# EasyEDA Pro project ProDoc_HyperCardReader_2024-07-06.epro

# Schematic HyperCardReader
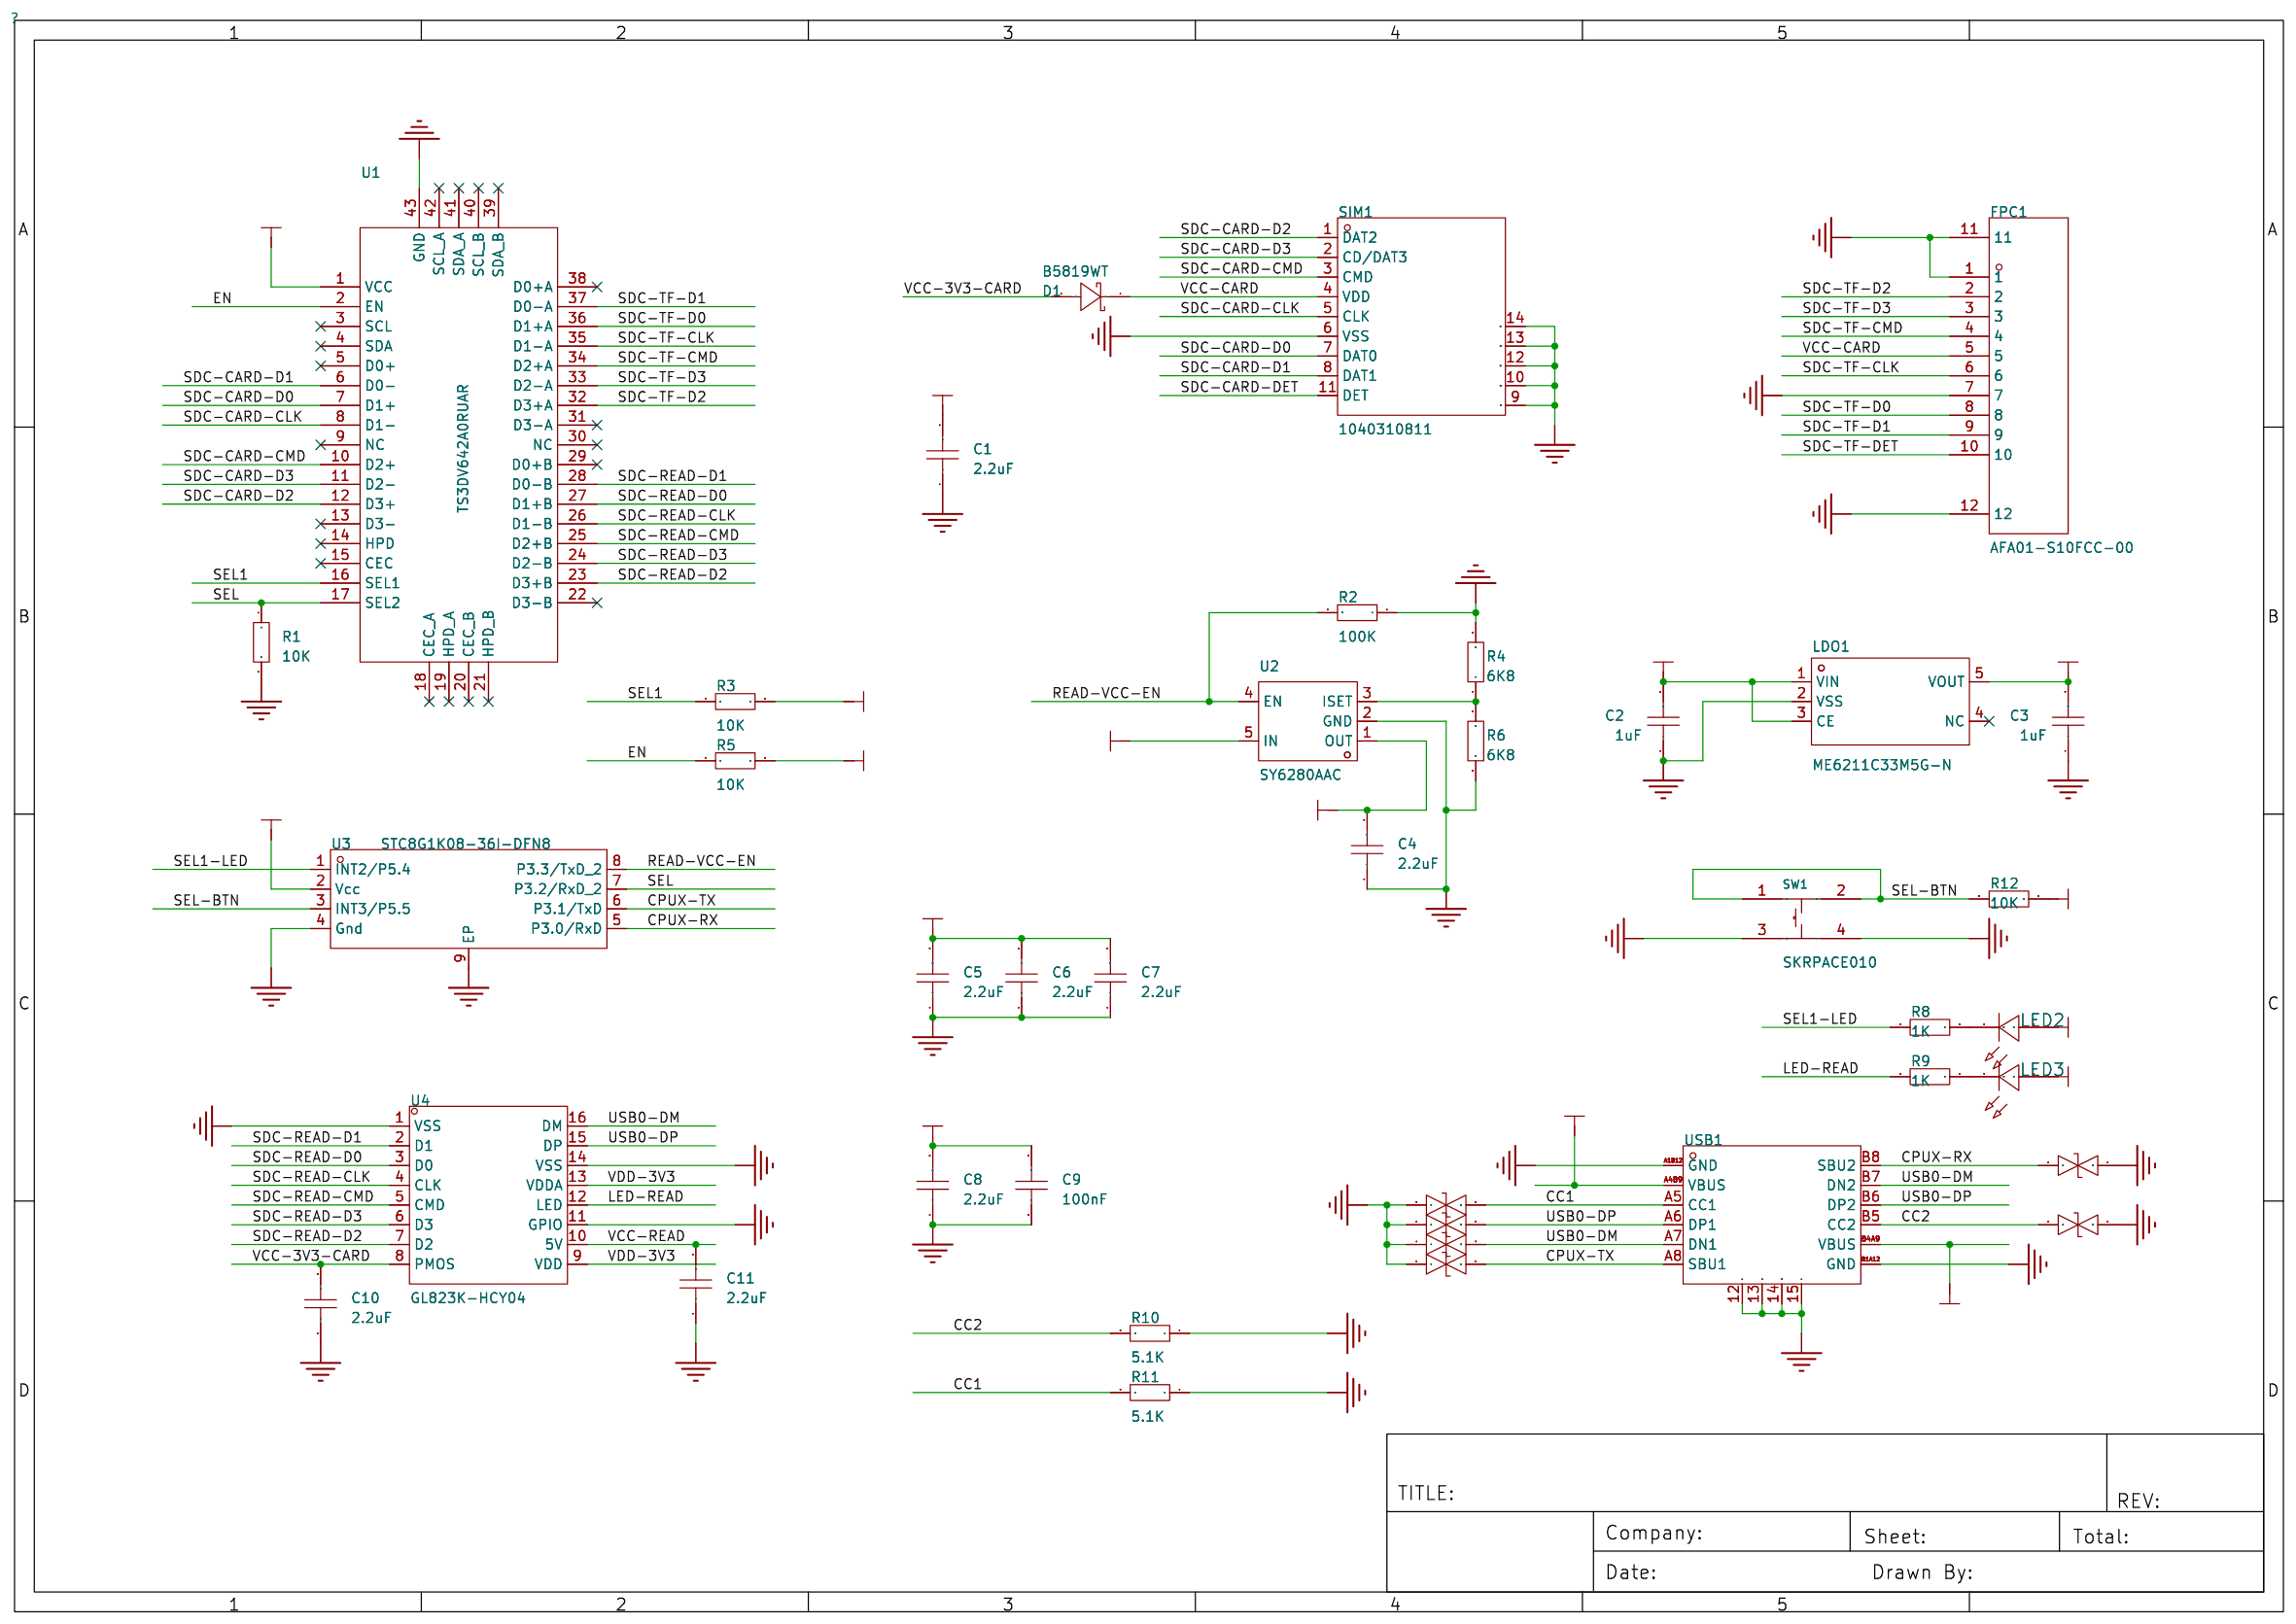
[diagram p0: schematic sheet]

## Parts
C1  2.2uF  [c0402-nsk]
C2  1uF  [C0603-NSK]
C3  1uF  [C0603-NSK]
C4  2.2uF  [c0402-nsk]
C5  2.2uF  [c0402-nsk]
C6  2.2uF  [c0402-nsk]
C7  2.2uF  [c0402-nsk]
C8  2.2uF  [c0402-nsk]
C9  100nF  [c0402-nsk]
C10  2.2uF  [c0402-nsk]
C11  2.2uF  [c0402-nsk]
D1  B5819WT  [SOD-523_L1.2-W0.8-LS1.6-RD-1 NSK]
D2  0402ESDA-05N  [d0402]
D3  0402ESDA-05N  [d0402]
D4  0402ESDA-05N  [d0402]
D5  0402ESDA-05N  [d0402]
D6  0402ESDA-05N  [d0402]
D7  0402ESDA-05N  [d0402]
FPC1  AFA01-S10FCC-00  [FPC-SMD_AFA01-S10FCC-00]
LDO1  ME6211C33M5G-N  [SOT-23-5_L3.0-W1.7-P0.95-LS2.8-BL]
LED2  -  [LED_0603]
LED3  -  [LED_0603]
R1  10K  [r0201 nsk]
R2  100K  [r0201 nsk]
R3  10K  [r0201 nsk]
R4  6K8  [r0201 nsk]
R5  10K  [r0201 nsk]
R6  6K8  [r0201 nsk]
R8  1K  [r0201 nsk]
R9  1K  [r0201 nsk]
R10  5.1K  [r0201 nsk]
R11  5.1K  [r0201 nsk]
R12  10K  [r0201 nsk]
SIM1  1040310811  [SIM-SMD_8P-1040310811]
SW1  SKRPACE010  [KEY-SMD_4P-L4.2-W3.2-P2.20-LS4.6]
U1  TS3DV642A0RUAR  [WFQFN-42_L9.0-W3.5-P0.50-BL-EP]
U2  SY6280AAC  [SOT-23-5_L3.0-W1.7-P0.95-LS2.8-BL]
U3  STC8G1K08-36I-DFN8  [DFN-8_L3.0-W3.0-P0.50-BL-EP]
U4  GL823K-HCY04  [SSOP-16_L4.9-W3.9-P0.64-LS6.0-BL]
USB1  -  [USB-C-SMD_TYPEC-304-BCP16-1]

## Library data of the parts
C1 C4-C11 = CAP_0402: Supplier Footprint: 0402
C2 C3 = CAP_0603: Supplier Footprint: 0603
D1 = B5819WT_C2997265: 二极管配置:-;正向压降(Vf):600mV@200mA;直流反向耐压(Vr):40V;平均整流电流(Io):1A;; LCSC Part Name: 电压:40V 电流:1A; Supplier Part: C2997265; Manufacturer: BORN(伯恩半导体); Supplier Footprint: SOD-523; JLCPCB Part Class: 扩展库; Datasheet: https://atta.szlcsc.com/upload/public/pdf/source/20220826/529B3A9034D5C6632B715AD177467069.pdf; Supplier: LCSC; Forward Voltage (Vf@If): 600mV@200mA; Reverse Voltage (Vr): 40V; Average Rectified Current (Io): 1A; Reverse Leakage Current (Ir): 5uA@30V
D2-D7 = 0402ESDA-05N: 极性:Bidirectional;反向关断电压（典型值）:5V;击穿电压（最小值）:-;箝位电压:50V;峰值脉冲电流（10/1000us）:-;; Supplier Part: C316049; Manufacturer: BORN伯恩半导体; Supplier Footprint: 0402; JLCPCB Part Class: Extended Part; Datasheet: https://atta.szlcsc.com/upload/public/pdf/source/20181026/C316049_37ABAC87650F175221BFB473159300DE.pdf; Supplier: LCSC; Polarity: Bidirectional; Reverse Stand-Off Voltage (Vrwm): 5V; Clamping Voltage@Ipp: 50V; Voltage - Reverse Standoff (Typ): 5V; Voltage - Clamping (Max) @ Ipp: 50V
FPC1 = AFA01-S10FCC-00: 锁定特性:翻盖式;触点类型:下接;触点数量:10P;间距:1mm;安装类型:卧贴;; LCSC Part Name: 间距:1mm P数:10P 翻盖式 下接; Supplier Part: C262385; Manufacturer: JS(钜硕电子); Supplier Footprint: SMD,P=1mm,卧贴; JLCPCB Part Class: 扩展库; Datasheet: https://atta.szlcsc.com/upload/public/pdf/source/20180820/C262762_EBECD0847A529CA64FD00527F6604CA9.pdf; Supplier: LCSC; Locking Feature: 翻盖式; Contact Type: 下接; Number of Contacts: 10P; Pitch: 1mm; Mounting Type: 卧贴; FFC, FCB Thickness: 0.3mm; Height Above Board: 2mm
LDO1 = ME6211C33M5G-N: 输出类型:固定;最大输入电压:6V;输出电压:3.3V;最大输出电流:500mA;电源纹波抑制比(PSRR):70dB;输出极性:正极;; LCSC Part Name: 输入6V 输出3.3V 500mA; Supplier Part: C82942; Manufacturer: MICRONE(南京微盟); Supplier Footprint: SOT-23-5; JLCPCB Part Class: 扩展库; Datasheet: https://atta.szlcsc.com/upload/public/pdf/source/20170918/C82942_1505727073070976520.pdf; Supplier: LCSC; Output Type: 固定; Maximum Input Voltage: 6V; Output Voltage: 3.3V; MAX Output Current: 500mA; Power Supply Rejection Ratio (PSRR): 70dB; Dropout Voltage: 260mV@(200mA); Output Polarity: 正极; Number of Outputs: 1
LED2 LED3 = LED_0603-R: Supplier Footprint: 0603
R1-R6 R8-R12 = Res_0201: Supplier Footprint: 0201
SIM1 = 1040310811: 卡连接方式:拔插式;卡类型:MicroSD卡(TF卡);连接器类型:卡座;本体最大高度:1.42mm;触头镀层:金;工作温度范围:-;; LCSC Part Name: 拔插式 MicroSD卡(TF卡) 卡座; Supplier Part: C585350; Manufacturer: MOLEX; Supplier Footprint: SMD; JLCPCB Part Class: 扩展库; Datasheet: https://atta.szlcsc.com/upload/public/pdf/source/20201117/C585350_D1F0B30BD23514449186B2E50ACE8BBF.pdf; Supplier: LCSC; Card Connection Mode: 拔插式; Card Type: MicroSD卡(TF卡); Connector Type: 卡座; Maximum Body Height: 1.42mm; Contact Plating: 金
SW1 = SKRPACE010: 电路结构:单刀单掷;按钮形状:椭圆形按钮;安装方式:立贴;开关长度:4.2mm;开关宽度:3.2mm;开关高度:2.5mm;触点电流:50mA;额定电压(DC):16V;带灯:-;机械寿命:-;; LCSC Part Name: 4.2*3.2*2.5mm 立贴 轻触开关; Supplier Part: C139797; Manufacturer: ALPSALPINE(阿尔卑斯阿尔派); Supplier Footprint: SMD; JLCPCB Part Class: 扩展库; Datasheet: https://atta.szlcsc.com/upload/public/pdf/source/20171113/C139797_15105612676371115729.pdf; Supplier: LCSC; Circuit: 单刀单掷; Actuator Style: 椭圆形按钮; Mounting Style: 立贴; Switch Length: 4.2mm; Switch Width: 3.2mm; Switch Height: 2.5mm; Contact Current: 50mA; Voltage Rating (DC): 16V
U1 = TS3DV642A0RUAR: 开关电路:-;; Supplier: LCSC; Supplier Part: C157482; Manufacturer: TI(德州仪器); Supplier Footprint: WFQFN-42-EP(3.5x9); Datasheet: https://www.ti.com/cn/lit/gpn/ts3dv642
U2 = SY6280AAC_C55136: 低能耗配电开关; Supplier Part: C55136; Manufacturer: silergy(矽力杰); Supplier Footprint: SOT-23-5; JLCPCB Part Class: 扩展库; Datasheet: https://atta.szlcsc.com/upload/public/pdf/source/20161108/1478586372822.pdf; Supplier: LCSC
U3 = STC8G1K08-36I-DFN8: CPU内核:51系列;程序存储容量:8KB;RAM总容量:1.25KB;GPIO端口数量:6;工作电压范围:1.9V~5.5V;CPU最大主频:-;程序存储器类型:FLASH;; Supplier Part: C915662; Manufacturer: STC(宏晶); Supplier Footprint: DFN-8-EP(3x3); JLCPCB Part Class: 扩展库; Datasheet: https://atta.szlcsc.com/upload/public/pdf/source/20230914/7707908C45C6343AE73767C1466DDB8D.pdf; Supplier: LCSC; CPU Core: 51系列; Program Storage Size: 8KB; RAM Size: 1.25KB; GPIO Ports Number: 6; Operating Voltage Range: 1.9V~5.5V; Program Memory Type: FLASH; Operating Temperature Range: -40℃~+85℃; 16Bit Timer: 2; UART/USART: 1; I2C: 1; SPI: 1; Peripheral/Function: 低电压检测；看门狗；除法器；乘法器; Watchdog: 有; Low-Voltage Detect: 有; Internal Oscillator: 有
U4 = GL823K-HCY04: 应用功能:-;接口协议:-;; Supplier Part: C284879; Manufacturer: GENESYS(创惟); Supplier Footprint: SSOP-16-150mil; JLCPCB Part Class: 扩展库; Datasheet: https://atta.szlcsc.com/upload/public/pdf/source/20190212/C284879_D3054E8AA735401C3047DCECFFFED6D3.pdf; Supplier: LCSC
USB1 = TYPEC-304-BCP16: Pin Type: IN; Supplier: LCSC; Supplier Part: C720629; Manufacturer: XUNPU; JLCPCB Part Class: 扩展库; Check: false

## Nets
GND: C1.1 C2.1 C3.1 C4.1 C5.1 C6.1 C7.1 C8.1 C9.1 C10.1 C11.1 D2.1 D3.1 D4.1 D5.1 D6.1 D7.1 FPC1.1 FPC1.7 FPC1.11 FPC1.12 LDO1.2(VSS) R1.2 R2.1 R4.2 R6.1 R10.1 R11.1 SIM1.6(VSS) SIM1.9 SIM1.10 SIM1.12 SIM1.13 SIM1.14 SW1.3 SW1.4 U1.43(GND) U2.2(GND) U3.4(Gnd) U3.9(EP) U4.1(VSS) U4.11(GPIO) U4.14(VSS) USB1.12(1) USB1.13(2) USB1.14(3) USB1.15(4) USB1.A1B12(GND) USB1.B1A12(GND)
VBUS-USB: C2.2 C5.2 C6.2 C7.2 LDO1.1(VIN) LDO1.3(CE) U2.5(IN) USB1.A4B9(VBUS) USB1.B4A9(VBUS)
VCC-3V3-CARD: C10.2 D1.2(A) U4.8(PMOS)
VCC-3V3-LDO: C3.2 LDO1.5(VOUT) LED2.2(A) R3.2 R5.2 R12.1 U1.1(VCC) U3.2(Vcc)
VCC-CARD: C1.2 D1.1(K) FPC1.5 SIM1.4(VDD)
VCC-READ: C4.2 C11.2 U2.1(OUT) U4.10(5V)
VDD-3V3: C8.2 C9.2 LED3.2(A) U4.9(VDD) U4.13(VDDA)
CC1: D3.2 R11.2 USB1.A5(CC1)
CC2: D6.2 R10.2 USB1.B5(CC2)
CPUX-RX: D2.2 U3.5(P3.0/RxD) USB1.B8(SBU2)
CPUX-TX: D7.2 U3.6(P3.1/TxD) USB1.A8(SBU1)
EN: R5.1 U1.2(EN)
LED-READ: R9.2 U4.12(LED)
READ-VCC-EN: R2.2 U2.4(EN) U3.8(P3.3/TxD_2)
SDC-CARD-CLK: SIM1.5(CLK) U1.8(D1-)
SDC-CARD-CMD: SIM1.3(CMD) U1.10(D2+)
SDC-CARD-D0: SIM1.7(DAT0) U1.7(D1+)
SDC-CARD-D1: SIM1.8(DAT1) U1.6(D0-)
SDC-CARD-D2: SIM1.1(DAT2) U1.12(D3+)
SDC-CARD-D3: SIM1.2(CD/DAT3) U1.11(D2-)
SDC-CARD-DET: SIM1.11(DET)
SDC-READ-CLK: U1.26(D1-B) U4.4(CLK)
SDC-READ-CMD: U1.25(D2+B) U4.5(CMD)
SDC-READ-D0: U1.27(D1+B) U4.3(D0)
SDC-READ-D1: U1.28(D0-B) U4.2(D1)
SDC-READ-D2: U1.23(D3+B) U4.7(D2)
SDC-READ-D3: U1.24(D2-B) U4.6(D3)
SDC-TF-CLK: FPC1.6 U1.35(D1-A)
SDC-TF-CMD: FPC1.4 U1.34(D2+A)
SDC-TF-D0: FPC1.8 U1.36(D1+A)
SDC-TF-D1: FPC1.9 U1.37(D0-A)
SDC-TF-D2: FPC1.2 U1.32(D3+A)
SDC-TF-D3: FPC1.3 U1.33(D2-A)
SDC-TF-DET: FPC1.10
SEL: R1.1 U1.17(SEL2) U3.7(P3.2/RxD_2)
SEL1: R3.1 U1.16(SEL1)
SEL1-LED: R8.2 U3.1(INT2/P5.4)
SEL-BTN: R12.2 SW1.1 SW1.2 U3.3(INT3/P5.5)
USB0-DM: D5.2 U4.16(DM) USB1.A7(DN1) USB1.B7(DN2)
USB0-DP: D4.2 U4.15(DP) USB1.A6(DP1) USB1.B6(DP2)
$1N1961: R4.1 R6.2 U2.3(ISET)
$1N4375: LED3.1(C) R9.1
$1N4433: LED2.1(C) R8.1

Not connected (* = marked no-connect by the designer): LDO1 4(NC)*; U1 3(SCL)* 4(SDA)* 5(D0+)* 9(NC)* 13(D3-)* 14(HPD)* 15(CEC)* 18(CEC_A)* 19(HPD_A)* 20(CEC_B)* 21(HPD_B)* 22(D3-B)* 29(D0+B)* 30(NC)* 31(D3-A)* 38(D0+A)* 39(SDA_B)* 40(SCL_B)* 41(SDA_A)* 42(SCL_A)*

# Board HyperCardReader
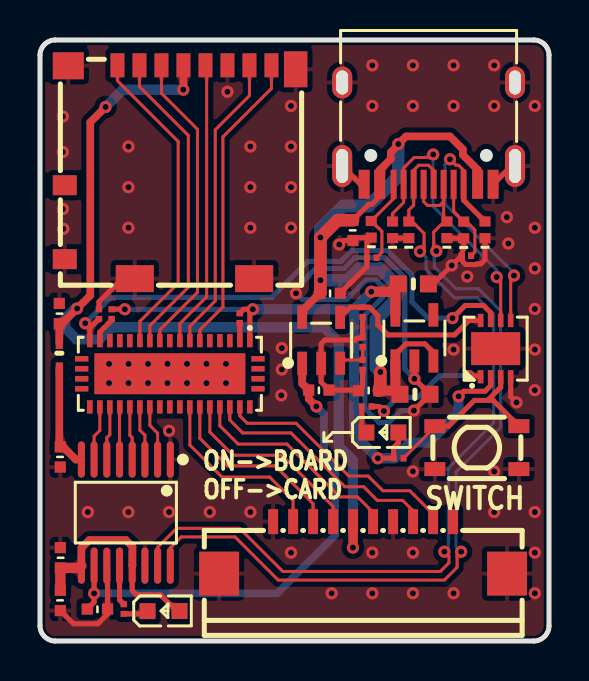
[diagram p1: board, top side]
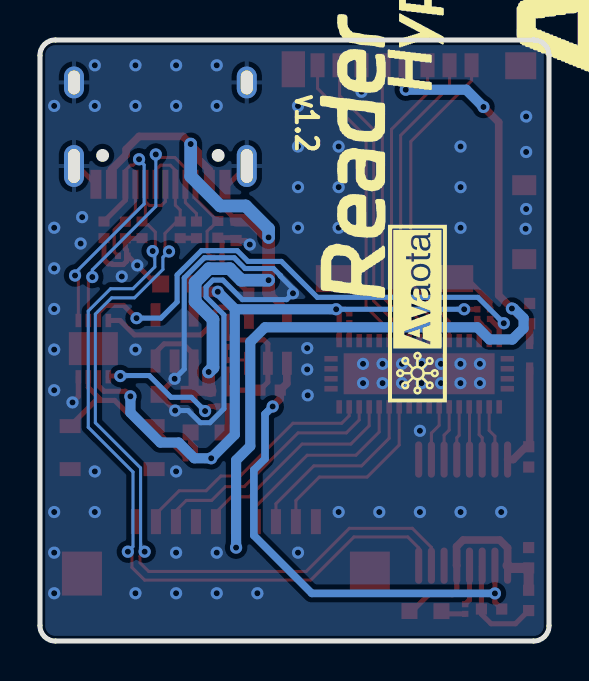
[diagram p2: board, bottom side, seen from below]

Outline 25.45 x 30.07 mm; copper layers: Top Layer, Bottom Layer. Coordinates in mm from the lower left corner of the outline.
Outline path: 0,29.31 0,0.76 arc(0.22,0.22) 0.76,0 24.69,0 arc(25.23,0.22) 25.45,0.76 25.45,29.31 arc(25.23,29.85) 24.69,30.07 0.76,30.07 arc(0.22,29.85) 0,29.31
Stack: Top Layer 0.035mm / Dielectric1 1.51mm FR4 er 4.5 / Bottom Layer 0.035mm

## Design rules (mm)
template: JLCPCB Capability(Two Layers Board)
spacing copperThickness1oz (default): track to track 0.102, other pairs 0.152 to 0.3
spacing copperThickness2oz: track to track 0.203, other pairs 0.152 to 0.3
track width copperThickness1oz (default): min 0.127, default 0.254, max 2.54
track width copperThickness2oz: min 0.203, default 0.254, max 2.54
differential pair differentialPair (default): width min 0.127, default 0.254, max 2.54; gap min 0.152, default 0.152
via viaSize (default): diameter min 0.5, default 0.61, max 10; hole min 0.3, default 0.305, max 6.3

## Placement (name value [footprint] x y rotation side)
C1  2.2uF  [c0402-nsk]  0.97 16.38 270 top
C2  1uF  [C0603-NSK]  18.75 12.34 180 top
C3  1uF  [C0603-NSK]  18.67 17.87 180 top
C4  2.2uF  [c0402-nsk]  13.94 12.55 180 top
C5  2.2uF  [c0402-nsk]  14.5 17.41 180 top
C6  2.2uF  [c0402-nsk]  15.65 20.55 90 top
C7  2.2uF  [c0402-nsk]  16.43 12.52 0 top
C8  2.2uF  [c0402-nsk]  1.02 4.17 270 top
C9  100nF  [c0402-nsk]  1.02 2.03 90 top
C10  2.2uF  [c0402-nsk]  1.01 9.21 90 top
C11  2.2uF  [c0402-nsk]  2.87 1.6 180 top
D1  B5819WT  [SOD-523_L1.2-W0.8-LS1.6-RD-1 NSK]  0.97 14.27 270 top
D2  0402ESDA-05N  [d0402]  22.25 20.57 90 top
D3  0402ESDA-05N  [d0402]  21.19 20.57 90 top
D4  0402ESDA-05N  [d0402]  18.44 20.57 90 top
D5  0402ESDA-05N  [d0402]  20.35 20.57 90 top
D6  0402ESDA-05N  [d0402]  16.56 20.6 90 top
D7  0402ESDA-05N  [d0402]  17.63 20.57 90 top
FPC1  AFA01-S10FCC-00  [FPC-SMD_AFA01-S10FCC-00]  16.15 4.67 0 top
LDO1  ME6211C33M5G-N  [SOT-23-5_L3.0-W1.7-P0.95-LS2.8-BL]  18.72 15.16 0 top
LED2  -  [LED_0603]  17.17 10.44 0 top
LED3  -  [LED_0603]  6.23 1.51 0 top
R1  10K  [r0201 nsk]  2.95 16.36 90 top
R2  100K  [r0201 nsk]  16.13 16.46 90 top
R3  10K  [r0201 nsk]  3.58 16.36 90 top
R4  6K8  [r0201 nsk]  16.13 14.96 90 top
R5  10K  [r0201 nsk]  9.98 16.15 90 top
R6  6K8  [r0201 nsk]  16.13 13.82 90 top
R8  1K  [r0201 nsk]  16.33 11.73 0 top
R9  1K  [r0201 nsk]  4.19 1.6 90 top
R10  5.1K  [r0201 nsk]  16.59 19.18 0 top
R11  5.1K  [r0201 nsk]  21.31 19.28 0 top
R12  10K  [r0201 nsk]  17.93 9.14 0 top
SIM1  1040310811  [SIM-SMD_8P-1040310811]  7.01 23.47 180 top
SW1  SKRPACE010  [KEY-SMD_4P-L4.2-W3.2-P2.20-LS4.6]  21.84 9.68 0 top
U1  TS3DV642A0RUAR  [WFQFN-42_L9.0-W3.5-P0.50-BL-EP]  6.49 13.37 180 top
U2  SY6280AAC  [SOT-23-5_L3.0-W1.7-P0.95-LS2.8-BL]  14.06 15.05 0 top
U3  STC8G1K08-36I-DFN8  [DFN-8_L3.0-W3.0-P0.50-BL-EP]  22.78 14.63 0 top
U4  GL823K-HCY04  [SSOP-16_L4.9-W3.9-P0.64-LS6.0-BL]  4.29 6.43 180 top
USB1  -  [USB-C-SMD_TYPEC-304-BCP16-1]  19.43 25.4 180 top

## Footprints (pads in the part's own frame, mm; a bottom-side part is the same pattern mirrored in y, then rotated)
c0402-nsk
  rect 0.559x0.559 smd: 1(-0.508,0) 2(0.508,0)
C0603-NSK
  rect 0.85x0.85 smd: 1(-0.75,0) 2(0.75,0)
d0402
  rect 0.505x0.551 smd: 1(-0.416,0) 2(0.416,0)
DFN-8_L3.0-W3.0-P0.50-BL-EP
  rect 0.28x0.665 smd: 1(-0.75,-1.407) 2(-0.25,-1.407) 3(0.25,-1.407) 4(0.75,-1.407) 5(0.75,1.407) 6(0.25,1.407) 7(-0.25,1.407) 8(-0.75,1.407)
  rect 2.45x1.65 smd: 9(0,0)
FPC-SMD_AFA01-S10FCC-00
  rect 0.5x1.25 smd: 1(-4.5,1.3) 2(-3.5,1.3) 3(-2.501,1.3) 4(-1.5,1.3) 5(-0.5,1.3) 6(0.499,1.3) 7(1.5,1.3) 8(2.499,1.3) 9(3.5,1.3) 10(4.5,1.3)
  rect 2x2.2 smd: 11(-7.2,-1.3) 12(7.2,-1.3)
KEY-SMD_4P-L4.2-W3.2-P2.20-LS4.6
  rect 1.05x0.7 smd: 1(-2.1,1.075) 2(2.1,1.075) 3(-2.1,-1.075) 4(2.1,-1.075)
LED_0603
  rect 0.8x0.8 smd: 1(-0.851,-0.01) 2(0.75,-0.005)
r0201 nsk
  rect 0.303x0.324 smd: 1(-0.241,0) 2(0.241,0)
SIM-SMD_8P-1040310811
  rect 0.7x1.2 smd: 1(3.138,-5.338) 2(2.038,-5.338) 3(0.938,-5.338) 4(-0.163,-5.338) 5(-1.262,-5.338) 6(-2.362,-5.338) 7(-3.462,-5.338) 8(-4.562,-5.338)
  rect 1.17x1.8 smd: 9(-5.772,-5.138)
  rect 1.55x1.35 smd: 10(5.598,-5.312)
  rect 1.2x1 smd: 11(5.772,0.662) 12(5.772,4.362)
  rect 1.9x1.35 smd: 13(2.272,5.338) 14(-3.697,5.338)
SOD-523_L1.2-W0.8-LS1.6-RD-1 NSK
  rect 0.6x0.36 smd: 1(-0.635,0) 2(0.635,0)
SOT-23-5_L3.0-W1.7-P0.95-LS2.8-BL
  rect 0.49x1.157 smd: 1(-0.95,-1.153) 2(0,-1.153) 3(0.95,-1.153)
  rect 0.49x1.175 smd: 4(0.95,1.153) 5(-0.95,1.153)
SSOP-16_L4.9-W3.9-P0.64-LS6.0-BL
  oval 0.355x1.815 smd: 1(-2.223,-2.655) 2(-1.587,-2.655) 3(-0.953,-2.655) 4(-0.318,-2.655) 5(0.318,-2.655) 6(0.953,-2.655) 7(1.587,-2.655) 8(2.223,-2.655) 9(2.223,2.655) 10(1.587,2.655) 11(0.953,2.655) 12(0.318,2.655) 13(-0.318,2.655) 14(-0.953,2.655) 15(-1.587,2.655) 16(-2.223,2.655)
USB-C-SMD_TYPEC-304-BCP16-1
  oval 1x2.1 hole 0.6x1.7: 12(-4.32,1.633) 13(4.32,1.633)
  oval 1x1.6 hole 0.6x1.2: 14(-4.32,-2.547) 15(4.32,-2.547)
  rect 0.55x1.45 smd: A1B12(-3.225,2.547) A4B9(-2.45,2.547) B1A12(3.225,2.547) B4A9(2.45,2.547)
  rect 0.3x1.45 smd: A5(-1.25,2.547) A6(-0.25,2.547) A7(0.25,2.547) A8(1.25,2.547) B5(1.75,2.547) B6(0.75,2.547) B7(-0.75,2.547) B8(-1.75,2.547)
WFQFN-42_L9.0-W3.5-P0.50-BL-EP
  rect 0.28x0.665 smd: 1(-3.998,-1.657) 2(-3.498,-1.657) 3(-2.998,-1.657) 4(-2.498,-1.657) 5(-1.998,-1.657) 6(-1.498,-1.657) 7(-0.998,-1.657) 8(-0.497,-1.657) 9(0.003,-1.657) 10(0.502,-1.657) 11(1.002,-1.657) 12(1.502,-1.657) 13(2.002,-1.657) 14(2.502,-1.657) 15(3.002,-1.657) 16(3.502,-1.657) 17(4.003,-1.657) 22(4.003,1.657) 23(3.502,1.657) 24(3.002,1.657) 25(2.502,1.657) 26(2.002,1.657) 27(1.502,1.657) 28(1.002,1.657) 29(0.502,1.657) 30(0.003,1.657) 31(-0.497,1.657) 32(-0.998,1.657) 33(-1.498,1.657) 34(-1.998,1.657) 35(-2.498,1.657) 36(-2.998,1.657) 37(-3.498,1.657) 38(-3.998,1.657)
  rect 0.665x0.28 smd: 18(4.41,-0.75) 19(4.41,-0.25) 20(4.41,0.25) 21(4.41,0.75) 39(-4.405,0.75) 40(-4.405,0.25) 41(-4.405,-0.25) 42(-4.405,-0.75)
  rect 7.55x2.05 smd: 43(0.003,0)

## Nets
As in the schematic.

Pads without a net: LDO1 4; U1 3 4 5 9 13 14 15 18 19 20 21 22 29 30 31 38 39 40 41 42

## Via types
v1: diameter 0.61, hole 0.305, Top Layer to Bottom Layer, 102 vias

## Routing (per net, layer and track width the routed paths; a pad name or vN(x,y) marks a point on that pad's centre or on a via; arc(x,y) is an arc through that point)
GND: length 62.8
  Top Layer w0.254: D2.1 22.25,19.08 22.05,18.87 21.85,18.87 21.82,18.84 21.28,18.84 21.12,19 21.12,19.23 R11.1 ; R6.1 16.13,12.73 C7.1 15.89,12.55 C4.1 14.06,12.95 U2.2 14.06,14.87 14.25,15.06 15.76,15.06 15.85,15.15 16.08,15.15 R4.2 R2.1 ; R1.2 2.95,16.97 4.11,18.13 SIM1.13 ; U4.11 3.38,3.73 C11.1 3.38,1.35 2.9,0.86 1.68,0.86 C9.1 ; D7.1 D4.1 ; USB1.B1A12 16.03,22.85 USB1.13 ; v1(14.96,19.84) 15.16,20.04 C6.1 15.79,20.18 D6.1 16.34,19.97 R10.1 16.34,18.74 15.01,17.41 ; v1(18.69,11.53) 19.5,12.33 C2.1 v1(18.72,13.12) LDO1.2 ; USB1.12 23.57,23.77 USB1.A1B12 ; R11.1 v1(20.59,18.8) 19.66,17.87 C3.1 ; R11.1 21.12,19.33 21.12,19.56 21.19,19.62 D3.1 20.35,20.15 D5.1 ; U3.4 23.53,12.23 v1(23.83,11.94)
  Bottom Layer w0.254: v1(18.69,11.53) 18.05,11.53 17.44,10.92 16.95,10.92 16.25,11.62 16.25,16.32 17.15,17.21 17.15,17.72 16.8,18.06 16.31,18.06 15.33,17.08 13.12,17.08 v1(12.8,17.4) 12.8,17.63 13.44,18.26 13.44,18.3 13.78,18.64 15.2,18.64 15.74,19.18 17.23,19.18 18.24,18.17 18.24,13.6 v1(18.72,13.12)
  vias: v1(1.14,26.24) v1(1.14,24.47) v1(1.14,21.62) v1(1.17,20.62) v1(2.39,6.45) v1(3.45,13.87) v1(3.45,12.9) v1(4.42,24.74) v1(4.42,22.71) v1(4.42,20.68) v1(4.43,13.87) v1(4.43,12.9) v1(4.42,6.45) v1(5.4,13.87) v1(5.4,12.9) v1(6.38,13.87) v1(6.38,12.9) v1(6.45,10.52) v1(6.45,6.45) v1(7.35,13.87) v1(7.35,12.9) v1(8.32,13.87) v1(8.32,12.9) v1(8.49,6.45) v1(9.3,13.87) v1(9.3,12.9) v1(9.37,27.48) v1(10.52,24.74) v1(10.52,22.71) v1(10.52,20.68) v1(10.52,6.45) v1(12.09,14.66) v1(12.09,13.59) v1(12.06,12.29) v1(12.55,26.77) v1(12.55,24.74) v1(12.55,22.71) v1(12.55,20.68) v1(12.55,4.42) v1(14.58,2.39) v1(16.61,28.81) v1(16.61,26.77) v1(16.61,4.42) v1(16.61,2.39) v1(18.65,28.81) v1(18.65,26.77) v1(18.65,8.49) v1(18.65,4.42) v1(18.65,2.39) v1(20.68,28.81) v1(20.68,26.77) v1(20.68,14.58) v1(20.68,2.39) v1(21.36,18.24) v1(22.71,28.81) v1(22.71,26.77) v1(22.71,8.49) v1(22.71,6.45) v1(23.34,21.21) v1(23.42,19.89) v1(24.74,26.77) v1(24.74,20.68) v1(24.74,18.65) v1(24.74,16.61) v1(24.74,14.58) v1(24.74,12.55) v1(24.74,6.45) v1(24.74,4.42) v1(24.74,2.39)
VBUS-USB: length 40.1
  Top Layer w0.254: USB1.B4A9 16.98,22.23 16.6,21.85 16.44,21.85 C6.2 ; LDO1.1 17.77,14.34 18.3,14.87 19.24,14.87 19.67,14.44 19.67,13.66
  Top Layer w0.381: USB1.B4A9 16.98,23.56 17.54,24.12 17.54,24.45 17.92,24.83 v1(17.92,24.87) 18.3,25.25 20.5,25.25 21.15,24.6 21.15,24.32 21.88,23.58 USB1.A4B9 ; U2.5 13.11,16.52 14,17.41
  Top Layer w0.508: LDO1.1 17.77,12.57 17.82,12.52 ; 17.82,12.52 C7.2 ; 17.82,12.52 C2.2
  Top Layer w0.635: C7.2 17.02,12.6 v1(17.02,13.46) ; 14,17.41 14.02,17.43 v1(14.02,18.05) v1(14.02,20.19) 14.88,21.06 C6.2
  Bottom Layer w0.635: v1(14.02,20.19) 14.02,20.62 15.16,21.77 16.43,21.77 17.92,23.25 v1(17.92,24.87) ; v1(14.02,18.05) 15.39,18.05 15.96,18.63 17,18.63 17.69,17.94 17.69,16.98 16.8,16.09 16.8,13.68 v1(17.02,13.46)
VCC-3V3-CARD: length 5.4
  Top Layer w0.381: 0.97,9.91 1.79,9.08 2.07,9.08 ; 0.97,9.91 0.97,9.77 C10.2 ; 0.97,9.91 D1.2
VCC-3V3-LDO: length 36.9
  Top Layer w0.254: U1.1 10.49,16.45 v1(10.64,16.6) 10.19,16.6 R5.2 ; v1(16.89,9.14) R12.1 17.68,9.16 17.68,9.68 17.92,9.92 LED2.2 ; v1(20.93,12.24) 21.18,12.5 22.25,12.5 22.53,12.78 U3.2 ; R3.2 v1(4.24,16.6)
  Top Layer w0.508: v1(16.56,17.48) 17.52,17.48 17.77,17.72 ; 17.77,17.72 LDO1.5 ; 17.77,17.72 C3.2
  Bottom Layer w0.254: v1(4.24,16.6) v1(10.64,16.6)
  Bottom Layer w0.508: v1(16.56,17.48) 15.71,16.62 15.71,16.6 ; v1(20.93,12.24) 20.93,11.43 19.43,9.93 18.52,9.93 17.73,9.14 v1(16.89,9.14) 15.71,10.33 15.71,16.6 ; 15.71,16.6 v1(10.64,16.6)
VCC-CARD: length 45.9
  Top Layer w0.381: SIM1.4 7.17,27.59 v1(7.16,27.58) ; D1.1 C1.2 1.09,15.88 v1(1.85,16.64) 2.51,17.3 2.51,25.96 v1(3.28,26.72)
  Top Layer w0.457: FPC1.5 15.65,4.68 v1(15.65,4.67)
  Bottom Layer w0.508: v1(3.28,26.72) 4.14,27.58 v1(7.16,27.58) ; v1(15.65,4.67) 15.65,9.04 14.94,9.75 14.94,14.96 14.2,15.7 3.58,15.7 2.97,15.09 1.83,15.09 1.27,15.65 1.27,16.15 1.75,16.64 v1(1.85,16.64)
VCC-READ: length 24.9
  Top Layer w0.254: C11.2 2.71,1.94 v1(2.71,2.38) U4.10
  Top Layer w0.381: U2.1 13.11,12.88 C4.2 13.44,12.12 v1(13.82,11.73)
  Bottom Layer w0.381: v1(2.71,2.38) 11.86,2.38 14.76,5.28 14.76,8.56 14.2,9.12 14.2,11.35 v1(13.82,11.73)
VDD-3V3: length 11
  Top Layer w0.254: LED3.2 6.83,1.5 6.02,2.31 4.83,2.31 4.61,2.53 U4.13
  Top Layer w0.381: U4.9 2.07,4.66 2.46,5.05 4.29,5.05 4.62,4.72 4.62,3.78 U4.13
  Top Layer w0.508: U4.9 1.96,3.66 C8.2 C9.2
CC1: length 4.2
  Top Layer w0.152: R11.2 21.74,19.47 21.74,20.57 21.33,20.98 D3.2 20.85,21.32 20.85,21.34 20.72,21.47 20.7,21.47 20.68,21.49 USB1.A5
CC2: length 4.5
  Top Layer w0.152: R10.2 17.09,19.44 17.09,20.5 16.93,20.66 16.91,20.66 D6.2 17.68,22.14 USB1.B5
CPUX-RX: length 13.6
  Top Layer w0.152: USB1.B8 21.18,23.55 20.93,23.81 20.8,23.81 v1(20.5,24.1) ; U3.5 23.53,18.12 v1(23.7,18.29)
  Top Layer w0.254: D2.2 21.18,22.06 USB1.B8
  Bottom Layer w0.152: v1(20.5,24.1) 20.5,24.08 20.24,23.83 20.24,21.87 23.7,18.41 v1(23.7,18.29)
CPUX-TX: length 14.4
  Top Layer w0.152: U3.6 23.03,18.01 v1(22.83,18.21) ; D7.2 17.63,21.39 18.18,21.94 USB1.A8 18.18,23.67 18.71,24.19 19.51,24.19 v1(19.66,24.35)
  Bottom Layer w0.152: v1(22.83,18.21) 22.83,18.57 19.66,21.75 19.66,24.34
EN: length 0.9
  Top Layer w0.254: U1.2 9.99,15.9 R5.1
LED-READ: length 2
  Top Layer w0.254: U4.12 3.97,2.06 R9.2
READ-VCC-EN: length 8.4
  Top Layer w0.254: U2.4 15.5,16.7 R2.2 16.47,16.7 16.89,16.28 16.89,15.82 17.4,15.32 20.73,15.32 21.45,16.04 U3.8
SDC-CARD-CLK: length 14.4
  Top Layer w0.152: SIM1.5 8.33,28.75 8.33,17.22 6.99,15.88 U1.8
SDC-CARD-CMD: length 15.3
  Top Layer w0.152: U1.10 5.99,15.57 7.87,17.45 7.87,25.6 6.07,27.4 SIM1.3
SDC-CARD-D0: length 15
  Top Layer w0.152: U1.7 7.49,15.75 8.76,17.02 8.76,25.58 10.47,27.29 SIM1.7
SDC-CARD-D1: length 15.3
  Top Layer w0.152: U1.6 7.99,15.56 9.14,16.71 9.14,25.22 11.57,27.65 SIM1.8
SDC-CARD-D2: length 15.8
  Top Layer w0.152: SIM1.1 3.87,28.03 6.91,24.99 6.91,17.91 4.99,15.99 U1.12
SDC-CARD-D3: length 15.6
  Top Layer w0.152: SIM1.2 4.97,27.74 7.42,25.3 7.42,17.7 5.49,15.78 U1.11
SDC-READ-CLK: length 2.7
  Top Layer w0.152: U1.26 4.49,10.29 4.61,10.17 4.61,9.08
SDC-READ-CMD: length 2.6
  Top Layer w0.152: U1.25 3.97,11.7 3.97,9.08
SDC-READ-D0: length 2.7
  Top Layer w0.152: U1.27 4.99,10.55 5.25,10.3 5.25,9.08
SDC-READ-D1: length 2.8
  Top Layer w0.152: U1.28 5.49,10.79 5.88,10.4 5.88,9.08
SDC-READ-D2: length 2.8
  Top Layer w0.152: 2.71,9.08 2.71,10.25 2.99,10.54 U1.23
SDC-READ-D3: length 2.7
  Top Layer w0.152: U1.24 3.49,10.32 3.34,10.17 3.34,9.08
SDC-TF-CLK: length 10.9
  Top Layer w0.152: U1.35 8.99,10.77 9.91,9.86 12.34,9.86 14.99,7.21 15.88,7.21 16.65,6.44 FPC1.6
SDC-TF-CMD: length 9.7
  Top Layer w0.152: FPC1.4 14.65,6.73 12.09,9.3 9.65,9.3 8.49,10.46 U1.34
SDC-TF-D0: length 12.2
  Top Layer w0.152: U1.36 9.49,11.06 10.13,10.41 12.55,10.41 15.24,7.72 16.18,7.72 16.87,7.04 18.14,7.04 18.65,6.52 FPC1.8
SDC-TF-D1: length 12.5
  Top Layer w0.152: FPC1.9 19.65,6.36 18.49,7.52 17.15,7.52 16.41,8.25 15.44,8.25 12.8,10.9 10.36,10.9 9.99,11.27 U1.37
SDC-TF-D2: length 9.3
  Top Layer w0.152: U1.32 7.49,9.81 9.09,8.2 11.48,8.2 12.65,7.03 FPC1.2
SDC-TF-D3: length 9.5
  Top Layer w0.152: U1.33 7.99,10.14 9.37,8.76 11.76,8.76 13.65,6.87 FPC1.3
SEL: length 26.4
  Top Layer w0.254: U3.7 22.53,16.43 22.17,16.79 21.26,16.79 v1(20.62,16.15) ; v1(2.26,15.9) 2.26,15.89 2.49,15.66 ; 2.49,15.66 U1.17 ; 2.49,15.66 R1.1
  Bottom Layer w0.254: v1(20.62,16.15) 19.41,16.15 18.59,16.97 18.59,18.32 17.38,19.53 15.59,19.53 15.05,18.99 13.38,18.99 11.58,17.2 3.56,17.2 v1(2.26,15.9)
SEL1: length 1.4
  Top Layer w0.254: 3.61,16.14 3.61,16.08 3.39,15.86 3.39,15.85 3.22,15.69 3.21,15.69 2.99,15.46 U1.16
SEL1-LED: length 6.3
  Top Layer w0.254: v1(21.44,13.26) 22,13.26 U3.1 ; v1(17.2,11.51) 16.97,11.73 R8.2
  Bottom Layer w0.254: v1(21.44,13.26) 21.41,13.28 19.99,13.28 18.9,12.19 17.88,12.19 v1(17.2,11.51)
SEL-BTN: length 9
  Top Layer w0.152: R12.2 19.74,10.71 SW1.1
  Top Layer w0.254: SW1.1 20.43,10.75 21.72,12.04 22.38,12.04 ; 22.38,12.04 23.03,12.7 U3.3 ; 22.38,12.04 22.66,12.04 SW1.2
USB0-DM: length 41.5
  Top Layer w0.152: 20.18,21.99 USB1.B7 ; 20.18,21.99 20.18,21.16 D5.2 20.19,20.84 20.06,20.84 19.69,20.46 19.69,19.64 v1(19.82,19.51) ; 20.18,21.99 19.99,21.79 19.38,21.79 19.18,21.99 USB1.A7 ; U4.16 6.52,4.66 7.06,5.21 9.75,5.21 11.91,3.05 20.22,3.05 20.85,3.68 20.85,4.27 v1(21.06,4.47)
  Bottom Layer w0.152: v1(21.06,4.47) 20.8,4.72 20.8,8.46 23.04,10.69 23.04,16.51 21.92,17.63 20.8,17.63 19.71,18.72 19.71,19.41 v1(19.82,19.51)
USB0-DP: length 42.5
  Top Layer w0.152: v1(20.22,4.47) 20.45,4.24 20.45,3.91 20.02,3.48 12.14,3.48 9.98,5.64 6.83,5.64 5.88,4.69 U4.15 ; USB1.A6 19.68,23.55 19.43,23.81 18.94,23.81 18.68,23.55 USB1.B6 18.68,21.8 18.44,21.56 D4.2 18.52,21.07 19.2,20.4 19.2,19.69 v1(19,19.49)
  Bottom Layer w0.152: v1(20.22,4.47) 20.42,4.67 20.42,8.66 22.68,10.92 22.68,16.36 21.87,17.17 20.73,17.17 19.3,18.59 19.3,19.2 19.02,19.49 v1(19,19.49)
$1N1961: length 1.8
  Top Layer w0.152: U2.3 15.17,14.06 R6.2 R4.1
$1N4375: length 1.2
  Top Layer w0.254: R9.1 5.24,1.36 LED3.1
$1N4433: length 1.4
  Top Layer w0.254: R8.1 16.09,10.66 16.32,10.43

## Copper pours and planes (outline as drawn; the poured copper is in the pictures)
GND on Top Layer: -2.31,32.36 28.35,32.36 28.35,-1.63 -2.31,-1.63
GND on Bottom Layer: -2.8,32.89 27.86,32.89 27.86,-1.09 -2.8,-1.09

Small or netless copper shapes (teardrops, artwork), in the pictures only: 200 on Top Layer, 29 on Bottom Layer

## Text on the board
Bottom Silkscreen Layer: v1.2
Top Silkscreen Layer: ON->BOARD / OFF->CARD | SWITCH
